# Altium schematic sheet DC-DC модуль +3V3.SchDoc
size 209 x 297 mm; DocumentNumber: 2; SheetNumber: 2; SheetTotal: 11; ListNumber: 1
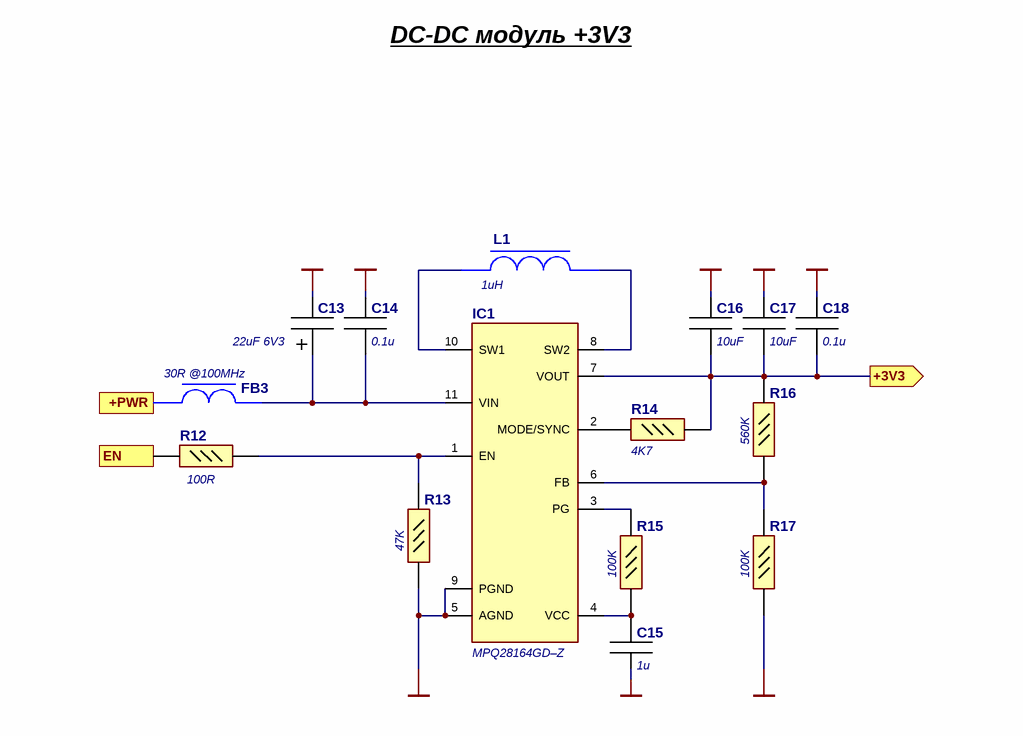
[diagram p0: DC-DC модуль +3V3.SchDoc]

## Parts
C13  22uF 6V3  [:CAP1206 C3216-18]
C14  0.1u  [:CAP0402 100x50x50]
C15  1u  [:CAP0603 C1608х08]
C16  10uF  [:CAP0805 C2012X125]
C17  10uF  [:CAP0805 C2012X125]
C18  0.1u  [:CAP0402 100x50x50]
FB3  30R @100MHz  [:FER BLM18SP300SN1D]
IC1  MPQ28164GD–Z  [:QFN11 P300X200X100-11N]
L1  1uH  [:IND1210 C3225]
R12  Manufacturer_Part_Number (part 2: value): 100R  [:RES0402]  (hidden comment: RC0402FR-07)
R13  Manufacturer_Part_Number (part 2: value): 47K  [:RES0402]  (hidden comment: RC0402FR-07)
R14  Manufacturer_Part_Number (part 2: value): 4K7  [:RES0402]  (hidden comment: RC0402FR-07)
R15  Manufacturer_Part_Number (part 2: value): 100K  [:RES0402]  (hidden comment: RC0402FR-07)
R16  Manufacturer_Part_Number (part 2: value): 560K  [:RES0402]  (hidden comment: RC0402FR-07)
R17  Manufacturer_Part_Number (part 2: value): 100K  [:RES0402]  (hidden comment: RC0402FR-07)

## Ports
+3V3 (out), +PWR (in), EN (in)

## Nets
GND: C13.2 C14.1 C15.1 C16.2 C17.2 C18.1 IC1.5(AGND) IC1.9(PGND) R13.1 R17.1
+3V3: C16.1 C17.1 C18.2 IC1.7(VOUT) R14.2 R16.2 ; port +3V3
+PWR: FB3.1 ; port +PWR
EN: R12.1 ; port EN
NetC13_1: C13.1(+) C14.2 FB3.2 IC1.11(VIN)
NetC15_2: C15.2 IC1.4(VCC) R15.1
NetIC1_1: IC1.1(EN) R12.2 R13.2
NetIC1_2: IC1.2(MODE/SYNC) R14.1
NetIC1_3: IC1.3(PG) R15.2
NetIC1_6: IC1.6(FB) R16.1 R17.2
NetIC1_8: IC1.8(SW2) L1.2
NetIC1_10: IC1.10(SW1) L1.1

## Notes on the sheet
- DC-DC модуль +3V3
- Подп. и дата
- Инв. № дубл.
- Взам. инв. №
- Инв. № подл.
- Лист
- Изм.
- № докум.
- Подп.
- Дата
- Копировал
- Формат А4

## Library data of the parts
C13 = TPSA226K006R0300: 22uF Molded Tantalum Capacitors 6.3V 1206 (3216 Metric) 300mOhm @ 100kHz; Manufacturer_Name: AVX; Short Description: 1206 22uF 6V3; Manufacturer_Part_Number: TPSA226K006R0300
C14 C18 = GRM155R71E104KE14J: ±10% 25V Ceramic Capacitor X7R 0402 (1005 Metric); Manufacturer_Name: Murata Electronics; Short Description: 0402 0.1uF 25V; Datasheet Link: http://www.murata.com/~/media/webrenewal/support/library/catalog/products/capacitor/mlcc/c02e.pdf; Height: 0.55mm; Manufacturer_Part_Number: GRM155R71E104KE14J; Mouser Part Number: 81-GRM155R71E104KE4J; Mouser Price/Stock: https://www.mouser.co.uk/ProductDetail/Murata-Electronics/GRM155R71E104KE14J?qs=hNud%2FORuBR2EQtvG2InwAQ%3D%3D; Arrow Part Number: GRM155R71E104KE14J; Arrow Price/Stock: https://www.arrow.com/en/products/grm155r71e104ke14j/murata-manufacturing
C15 = GCM188R71E105KA64D: ±10% 25V Ceramic Capacitor X7R 0603 (1608 Metric); Manufacturer_Name: Murata Electronics; Short Description: 0603 1u 25V; Height: 0.9mm; Manufacturer_Part_Number: GCM188R71E105KA64D
C16 C17 = C2012X5R1C106M085AC: CAP CER 10uF 16V X5R 0805; Manufacturer_Name: TDK; Short Description: 0805 10uF 16V; Datasheet Link: https://product.tdk.com/info/en/documents/chara_sheet/C2012X5R1C106M085AC.pdf; Height: 1.45mm; Manufacturer_Part_Number: C2012X5R1C106M085AC; Mouser Part Number: 810-C2012X5R1C106M-2; Mouser Price/Stock: https://www.mouser.co.uk/ProductDetail/TDK/C2012X5R1C106M085AC?qs=LcTL%2F5vFEzFm8m4UBfhWvw%3D%3D; Arrow Part Number: C2012X5R1C106M085AC; Arrow Price/Stock: https://www.arrow.com/en/products/c2012x5r1c106m085ac/tdk
FB3 = BLM18SP300SN1D: 30 Ohms @ 100MHz 1 Power Line Ferrite Bead 0603 (1608 Metric) 6A 8mOhm; Manufacturer_Name: Murata Electronics; Short Description: 0603 30R @100MHz; Datasheet Link: http://www.murata.com/~/media/webrenewal/support/library/catalog/products/emc/emifil/c31e.ashx?la=en-gb; Height: 0.95mm; Manufacturer_Part_Number: BLM18SP300SN1D; Mouser Part Number: 81-BLM18SP300SN1D; Mouser Price/Stock: https://www.mouser.co.uk/ProductDetail/Murata-Electronics/BLM18SP300SN1D/?qs=W%2FMpXkg%252BdQ4o%252BOP%252B6m8FYA%3D%3D
IC1 = MPQ28164GD–Z: DC/DC Converter / 1.2V to 5.5V Input / 1.5V to 5V Output 2A; Manufacturer_Name: Monolithic Power Systems (MPS); Short Description: 1.5...5V; Datasheet Link: https://componentsearchengine.com/Datasheets/1/MP28164GD-P.pdf; Height: 1mm; Manufacturer_Part_Number: MPQ28164GD–Z; Mouser Price/Stock: https://www.mouser.co.uk/ProductDetail/Monolithic-Power-Systems-MPS/MP28164GD-P/?qs=BHWkRorfSmXVYcyyqwr4xg%3D%3D
L1 = 74479299210: 1uH Shielded Molded Inductor 3A 46mOhm Max 1210 (3225 Metric) / Current - Saturation (Isat) 5.2A / Current Rating (Amps) 3A / Frequency - Self Resonant 50MHz; Manufacturer_Name: Würth Elektronik; Short Description: 1uH 3A 46mOhm; Manufacturer_Part_Number: 74479299210
R12-R17 = RC0402FR-07: Resistor 0402 1% 1/16W / Value Range: 1Ω ... 10 MΩ / Value Example: / 0R = 0Ω / 97R6 = 97.6Ω / 9K76 = 9760Ω / 1M = 1,000,000Ω; Manufacturer_Name: YAGEO; Manufacturer_Part_Number (part 3: after value): L; Short Description: 0402 1%; Datasheet Link: http://www.yageo.com/documents/recent/PYu-RC0402_51_RoHS_L_6_r.pdf; Height: 0.4mm; Manufacturer_Part_Number: RC0402FR-07; Parameter 1: *